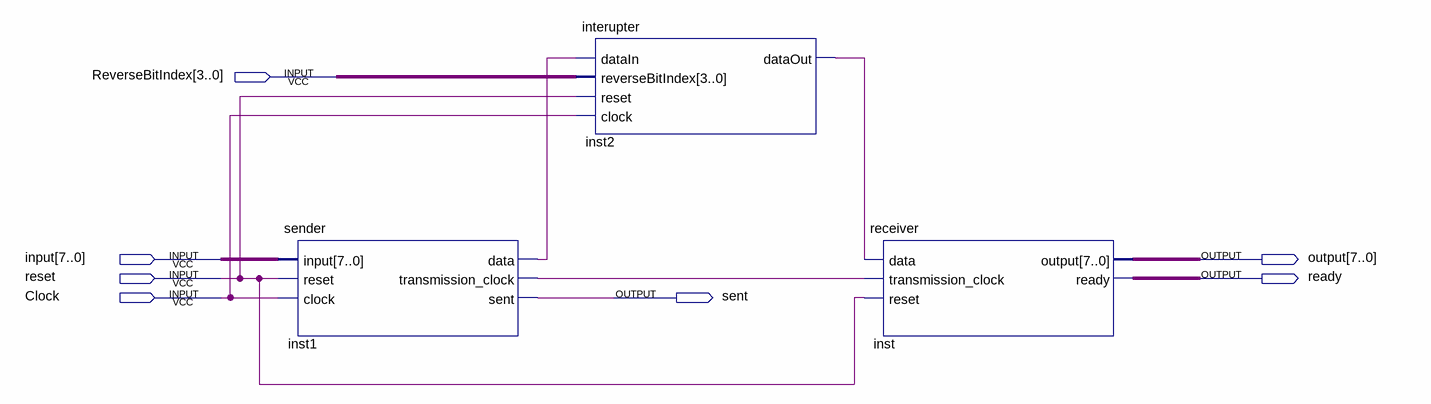
[diagram p0: schematic sheet]
// Quartus schematic Hamming.bdf as structural Verilog: 3 symbols, 7 pins
module Hamming (
  input  [3:0] ReverseBitIndex,
  input  [7:0] \input ,
  input  reset,
  input  Clock,
  output [7:0] \output ,
  output ready,
  output sent
);

  wire inst1_data, inst1_transmission_clock, inst2_dataout;

  sender inst1 (
    .\input (\input ), .reset(reset), .clock(Clock), .data(inst1_data),
    .transmission_clock(inst1_transmission_clock), .sent(sent));
  interupter inst2 (
    .dataIn(inst1_data), .reverseBitIndex(ReverseBitIndex), .reset(reset), .clock(Clock),
    .dataOut(inst2_dataout));
  receiver inst (
    .data(inst2_dataout), .transmission_clock(inst1_transmission_clock), .reset(reset), .\output (\output ),
    .ready(ready));
endmodule
